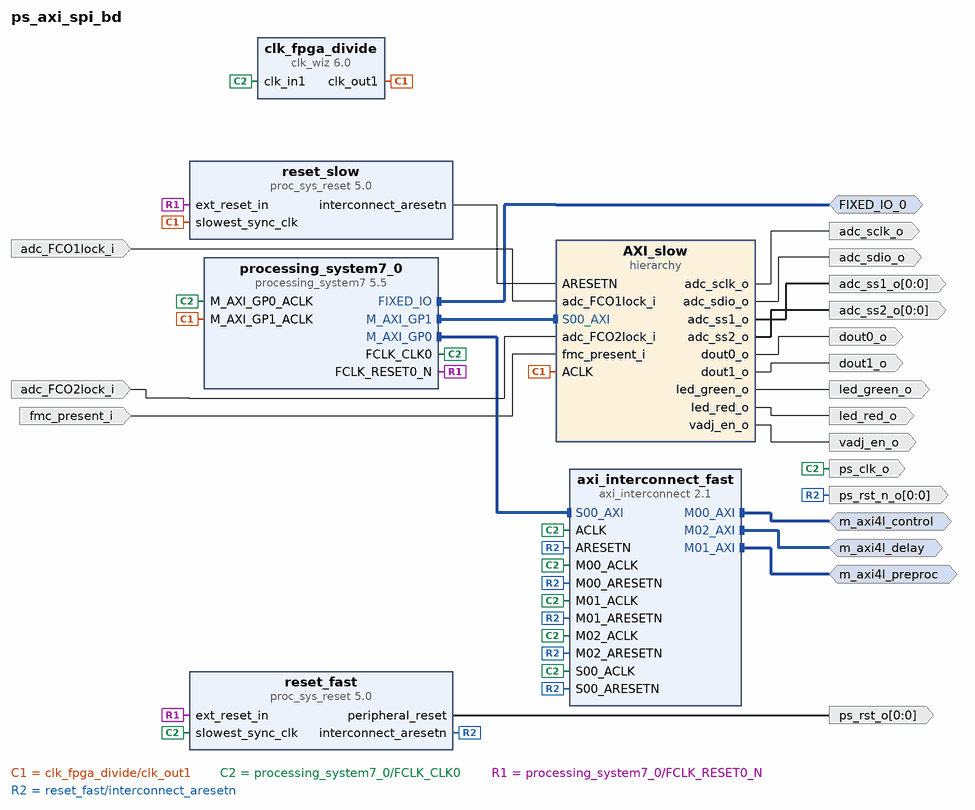
[diagram p0: block diagram of the top level]
# Vivado block design ps_axi_spi_bd, xc7z030fbg676-2, Vivado 2024.2
create_bd_design ps_axi_spi_bd

create_bd_intf_port -mode Master -vlnv xilinx.com:display_processing_system7:fixedio_rtl:1.0 FIXED_IO_0
create_bd_intf_port -mode Master -vlnv xilinx.com:interface:aximm_rtl:1.0 m_axi4l_control
set_property -dict [list \
  CONFIG.ADDR_WIDTH 32 \
  CONFIG.DATA_WIDTH 32 \
  CONFIG.FREQ_HZ 200000000 \
  CONFIG.NUM_READ_OUTSTANDING 2 \
  CONFIG.NUM_WRITE_OUTSTANDING 2 \
  CONFIG.PROTOCOL AXI4LITE \
] [get_bd_intf_ports m_axi4l_control]
create_bd_intf_port -mode Master -vlnv xilinx.com:interface:aximm_rtl:1.0 m_axi4l_delay
set_property -dict [list \
  CONFIG.ADDR_WIDTH 32 \
  CONFIG.DATA_WIDTH 32 \
  CONFIG.FREQ_HZ 200000000 \
  CONFIG.NUM_READ_OUTSTANDING 2 \
  CONFIG.NUM_WRITE_OUTSTANDING 2 \
  CONFIG.PROTOCOL AXI4LITE \
] [get_bd_intf_ports m_axi4l_delay]
create_bd_intf_port -mode Master -vlnv xilinx.com:interface:aximm_rtl:1.0 m_axi4l_preproc
set_property -dict [list \
  CONFIG.ADDR_WIDTH 32 \
  CONFIG.DATA_WIDTH 32 \
  CONFIG.FREQ_HZ 200000000 \
  CONFIG.NUM_READ_OUTSTANDING 2 \
  CONFIG.NUM_WRITE_OUTSTANDING 2 \
  CONFIG.PROTOCOL AXI4LITE \
] [get_bd_intf_ports m_axi4l_preproc]
create_bd_port -dir I adc_FCO1lock_i
create_bd_port -dir I adc_FCO2lock_i
create_bd_port -dir O adc_sclk_o
create_bd_port -dir O adc_sdio_o
create_bd_port -dir O -from 0 -to 0 adc_ss1_o
create_bd_port -dir O -from 0 -to 0 adc_ss2_o
create_bd_port -dir O dout0_o
create_bd_port -dir O dout1_o
create_bd_port -dir I fmc_present_i
create_bd_port -dir O led_green_o
create_bd_port -dir O led_red_o
create_bd_port -dir O -type clk ps_clk_o
set_property -dict [list \
  CONFIG.ASSOCIATED_BUSIF m_axi4l_control:m_axi4l_preproc:m_axi4l_delay \
  CONFIG.FREQ_HZ 200000000 \
] [get_bd_ports ps_clk_o]
create_bd_port -dir O -from 0 -to 0 -type rst ps_rst_n_o
create_bd_port -dir O -from 0 -to 0 -type rst ps_rst_o
create_bd_port -dir O vadj_en_o

create_bd_cell -type hier AXI_slow
create_bd_cell -type ip -vlnv xilinx.com:ip:axi_interconnect:2.1 axi_interconnect_fast
set_property -dict {CONFIG.NUM_MI 3} [get_bd_cells axi_interconnect_fast]
create_bd_cell -type ip -vlnv xilinx.com:ip:clk_wiz:6.0 clk_fpga_divide
set_property -dict [list \
  CONFIG.CLKOUT1_JITTER 129.198 \
  CONFIG.CLKOUT1_REQUESTED_OUT_FREQ 50 \
  CONFIG.MMCM_CLKOUT0_DIVIDE_F 20.000 \
  CONFIG.PRIM_SOURCE Global_buffer \
  CONFIG.USE_LOCKED false \
  CONFIG.USE_RESET false \
] [get_bd_cells clk_fpga_divide]
create_bd_cell -type ip -vlnv xilinx.com:ip:processing_system7:5.5 processing_system7_0
set_property -dict [list \
  CONFIG.PCW_APU_PERIPHERAL_FREQMHZ 800 \
  CONFIG.PCW_CPU_CPU_6X4X_MAX_RANGE 800 \
  CONFIG.PCW_ENET0_ENET0_IO {MIO 16 .. 27} \
  CONFIG.PCW_ENET0_GRP_MDIO_ENABLE 1 \
  CONFIG.PCW_ENET0_GRP_MDIO_IO {MIO 52 .. 53} \
  CONFIG.PCW_ENET0_PERIPHERAL_ENABLE 1 \
  CONFIG.PCW_FCLK2_PERIPHERAL_CLKSRC {DDR PLL} \
  CONFIG.PCW_FPGA0_PERIPHERAL_FREQMHZ 200 \
  CONFIG.PCW_FPGA1_PERIPHERAL_FREQMHZ 250 \
  CONFIG.PCW_FPGA2_PERIPHERAL_FREQMHZ 100 \
  CONFIG.PCW_GPIO_MIO_GPIO_ENABLE 0 \
  CONFIG.PCW_I2C0_GRP_INT_ENABLE 0 \
  CONFIG.PCW_I2C0_I2C0_IO {MIO 14 .. 15} \
  CONFIG.PCW_I2C0_PERIPHERAL_ENABLE 1 \
  CONFIG.PCW_I2C1_I2C1_IO {MIO 12 .. 13} \
  CONFIG.PCW_I2C1_PERIPHERAL_ENABLE 1 \
  CONFIG.PCW_I2C_PERIPHERAL_FREQMHZ 133.333328 \
  CONFIG.PCW_PERIPHERAL_BOARD_PRESET part0 \
  CONFIG.PCW_PRESET_BANK1_VOLTAGE {LVCMOS 1.8V} \
  CONFIG.PCW_QSPI_GRP_SINGLE_SS_ENABLE 1 \
  CONFIG.PCW_QSPI_GRP_SINGLE_SS_IO {MIO 1 .. 6} \
  CONFIG.PCW_QSPI_PERIPHERAL_ENABLE 1 \
  CONFIG.PCW_QSPI_PERIPHERAL_FREQMHZ 150 \
  CONFIG.PCW_QSPI_QSPI_IO {MIO 1 .. 6} \
  CONFIG.PCW_SD0_GRP_CD_ENABLE 0 \
  CONFIG.PCW_SD0_GRP_WP_ENABLE 0 \
  CONFIG.PCW_SD0_PERIPHERAL_ENABLE 1 \
  CONFIG.PCW_SD0_SD0_IO {MIO 40 .. 45} \
  CONFIG.PCW_SDIO_PERIPHERAL_FREQMHZ 50 \
  CONFIG.PCW_SINGLE_QSPI_DATA_MODE x4 \
  CONFIG.PCW_UART0_PERIPHERAL_ENABLE 1 \
  CONFIG.PCW_UART0_UART0_IO {MIO 10 .. 11} \
  CONFIG.PCW_UART1_PERIPHERAL_ENABLE 1 \
  CONFIG.PCW_UART1_UART1_IO {MIO 8 .. 9} \
  CONFIG.PCW_UART_PERIPHERAL_FREQMHZ 100 \
  CONFIG.PCW_UIPARAM_DDR_ENABLE 0 \
  CONFIG.PCW_USB0_PERIPHERAL_ENABLE 0 \
  CONFIG.PCW_USE_M_AXI_GP1 1 \
] [get_bd_cells processing_system7_0]
# 421 more settings of processing_system7_0 are not shown: defaults, MIO pin electricals, DDR timing, and values the tool derives
create_bd_cell -type ip -vlnv xilinx.com:ip:proc_sys_reset:5.0 reset_fast
set_property -dict [list \
  CONFIG.C_AUX_RST_WIDTH 1 \
  CONFIG.C_EXT_RST_WIDTH 1 \
  CONFIG.C_NUM_BUS_RST 1 \
  CONFIG.C_NUM_PERP_RST 1 \
] [get_bd_cells reset_fast]
create_bd_cell -type ip -vlnv xilinx.com:ip:proc_sys_reset:5.0 reset_slow
set_property -dict {CONFIG.C_EXT_RST_WIDTH 1} [get_bd_cells reset_slow]

# ---- hierarchy /AXI_slow ----
current_bd_instance /AXI_slow
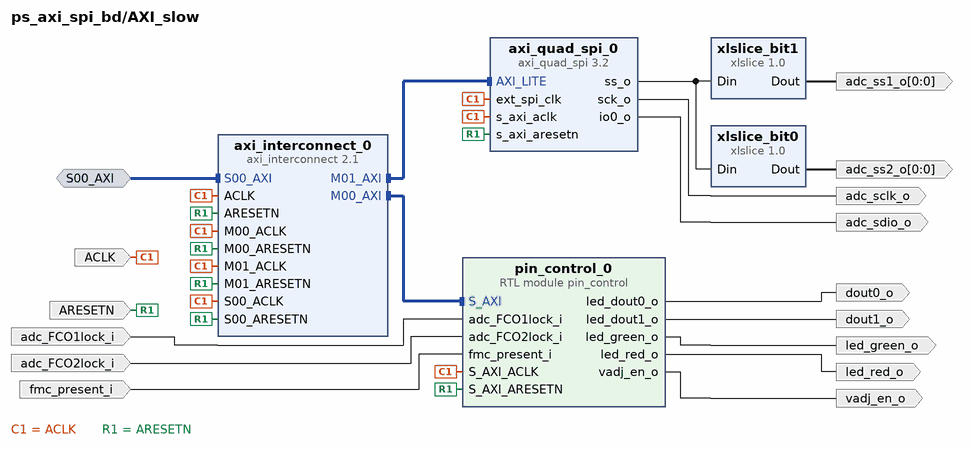
[diagram p1: block diagram inside /AXI_slow]
create_bd_intf_pin -mode Slave -vlnv xilinx.com:interface:aximm_rtl:1.0 S00_AXI
create_bd_pin -dir I -type clk ACLK
create_bd_pin -dir I -type rst ARESETN
create_bd_pin -dir I adc_FCO1lock_i
create_bd_pin -dir I adc_FCO2lock_i
create_bd_pin -dir O adc_sclk_o
create_bd_pin -dir O adc_sdio_o
create_bd_pin -dir O -from 0 -to 0 adc_ss1_o
create_bd_pin -dir O -from 0 -to 0 adc_ss2_o
create_bd_pin -dir O dout0_o
create_bd_pin -dir O dout1_o
create_bd_pin -dir I fmc_present_i
create_bd_pin -dir O led_green_o
create_bd_pin -dir O led_red_o
create_bd_pin -dir O vadj_en_o

create_bd_cell -type ip -vlnv xilinx.com:ip:axi_interconnect:2.1 axi_interconnect_0
create_bd_cell -type ip -vlnv xilinx.com:ip:axi_quad_spi:3.2 axi_quad_spi_0
set_property -dict [list \
  CONFIG.C_NUM_SS_BITS 2 \
  CONFIG.C_NUM_TRANSFER_BITS 8 \
  CONFIG.C_SCK_RATIO 2 \
  CONFIG.C_USE_STARTUP 0 \
] [get_bd_cells axi_quad_spi_0]
create_bd_cell -type module -reference pin_control pin_control_0
set_property -dict {CONFIG.MAX_COUNT_1MS 50000} [get_bd_cells pin_control_0]
create_bd_cell -type ip -vlnv xilinx.com:ip:xlslice:1.0 xlslice_bit0
set_property -dict {CONFIG.DIN_FROM 0 CONFIG.DIN_TO 0 CONFIG.DIN_WIDTH 2 CONFIG.DOUT_WIDTH 1} [get_bd_cells xlslice_bit0]
create_bd_cell -type ip -vlnv xilinx.com:ip:xlslice:1.0 xlslice_bit1
set_property -dict {CONFIG.DIN_FROM 1 CONFIG.DIN_TO 1 CONFIG.DIN_WIDTH 2 CONFIG.DOUT_WIDTH 1} [get_bd_cells xlslice_bit1]

# ---- connections ----

current_bd_instance /AXI_slow
connect_bd_intf_net [get_bd_intf_pins axi_interconnect_0/M00_AXI] [get_bd_intf_pins pin_control_0/S_AXI]
connect_bd_intf_net [get_bd_intf_pins axi_interconnect_0/M01_AXI] [get_bd_intf_pins axi_quad_spi_0/AXI_LITE]
connect_bd_intf_net -intf_net processing_system7_0_M_AXI_GP1 [get_bd_intf_pins S00_AXI] [get_bd_intf_pins axi_interconnect_0/S00_AXI]
connect_bd_net [get_bd_pins ACLK] \
  [get_bd_pins axi_interconnect_0/ACLK] [get_bd_pins axi_interconnect_0/M00_ACLK] [get_bd_pins axi_interconnect_0/M01_ACLK] \
  [get_bd_pins axi_interconnect_0/S00_ACLK] [get_bd_pins axi_quad_spi_0/ext_spi_clk] [get_bd_pins axi_quad_spi_0/s_axi_aclk] \
  [get_bd_pins pin_control_0/S_AXI_ACLK]
connect_bd_net -net ADC_AcqControl_adc_FCO1lck_o [get_bd_pins adc_FCO1lock_i] [get_bd_pins pin_control_0/adc_FCO1lock_i]
connect_bd_net -net ADC_AcqControl_adc_FCO2lck_o [get_bd_pins adc_FCO2lock_i] [get_bd_pins pin_control_0/adc_FCO2lock_i]
connect_bd_net [get_bd_pins axi_quad_spi_0/io0_o] [get_bd_pins adc_sdio_o]
connect_bd_net [get_bd_pins axi_quad_spi_0/sck_o] [get_bd_pins adc_sclk_o]
connect_bd_net [get_bd_pins axi_quad_spi_0/ss_o] [get_bd_pins xlslice_bit0/Din] [get_bd_pins xlslice_bit1/Din]
connect_bd_net -net fmc_present_i_0_1 [get_bd_pins fmc_present_i] [get_bd_pins pin_control_0/fmc_present_i]
connect_bd_net [get_bd_pins pin_control_0/led_dout0_o] [get_bd_pins dout0_o]
connect_bd_net [get_bd_pins pin_control_0/led_dout1_o] [get_bd_pins dout1_o]
connect_bd_net [get_bd_pins pin_control_0/led_green_o] [get_bd_pins led_green_o]
connect_bd_net [get_bd_pins pin_control_0/led_red_o] [get_bd_pins led_red_o]
connect_bd_net [get_bd_pins pin_control_0/vadj_en_o] [get_bd_pins vadj_en_o]
connect_bd_net -net reset_slow_interconnect_aresetn [get_bd_pins ARESETN] \
  [get_bd_pins axi_interconnect_0/ARESETN] [get_bd_pins axi_interconnect_0/M00_ARESETN] \
  [get_bd_pins axi_interconnect_0/M01_ARESETN] [get_bd_pins axi_interconnect_0/S00_ARESETN] \
  [get_bd_pins axi_quad_spi_0/s_axi_aresetn] [get_bd_pins pin_control_0/S_AXI_ARESETN]
connect_bd_net [get_bd_pins xlslice_bit0/Dout] [get_bd_pins adc_ss2_o]
connect_bd_net [get_bd_pins xlslice_bit1/Dout] [get_bd_pins adc_ss1_o]

current_bd_instance /
connect_bd_intf_net -intf_net S00_AXI_0_1 [get_bd_intf_pins axi_interconnect_fast/S00_AXI] [get_bd_intf_pins processing_system7_0/M_AXI_GP0]
connect_bd_intf_net [get_bd_intf_ports m_axi4l_control] [get_bd_intf_pins axi_interconnect_fast/M00_AXI]
connect_bd_intf_net [get_bd_intf_ports m_axi4l_preproc] [get_bd_intf_pins axi_interconnect_fast/M01_AXI]
connect_bd_intf_net [get_bd_intf_ports m_axi4l_delay] [get_bd_intf_pins axi_interconnect_fast/M02_AXI]
connect_bd_intf_net [get_bd_intf_ports FIXED_IO_0] [get_bd_intf_pins processing_system7_0/FIXED_IO]
connect_bd_intf_net [get_bd_intf_pins AXI_slow/S00_AXI] [get_bd_intf_pins processing_system7_0/M_AXI_GP1]
connect_bd_net -net ACLK_1 [get_bd_pins clk_fpga_divide/clk_out1] \
  [get_bd_pins AXI_slow/ACLK] [get_bd_pins processing_system7_0/M_AXI_GP1_ACLK] [get_bd_pins reset_slow/slowest_sync_clk]
connect_bd_net -net adc_FCO1lock_i_0_1 [get_bd_ports adc_FCO1lock_i] [get_bd_pins AXI_slow/adc_FCO1lock_i]
connect_bd_net -net adc_FCO2lock_i_0_1 [get_bd_ports adc_FCO2lock_i] [get_bd_pins AXI_slow/adc_FCO2lock_i]
connect_bd_net -net axi_spi_control_0_adc_sclk_o [get_bd_pins AXI_slow/adc_sclk_o] [get_bd_ports adc_sclk_o]
connect_bd_net -net axi_spi_control_0_adc_sdio_o [get_bd_pins AXI_slow/adc_sdio_o] [get_bd_ports adc_sdio_o]
connect_bd_net -net axi_spi_control_0_adc_ss1_o [get_bd_pins AXI_slow/adc_ss1_o] [get_bd_ports adc_ss1_o]
connect_bd_net -net axi_spi_control_0_adc_ss2_o [get_bd_pins AXI_slow/adc_ss2_o] [get_bd_ports adc_ss2_o]
connect_bd_net -net fmc_present_i_0_1 [get_bd_ports fmc_present_i] [get_bd_pins AXI_slow/fmc_present_i]
connect_bd_net -net pin_control_0_led_dout0_o [get_bd_pins AXI_slow/dout0_o] [get_bd_ports dout0_o]
connect_bd_net -net pin_control_0_led_dout1_o [get_bd_pins AXI_slow/dout1_o] [get_bd_ports dout1_o]
connect_bd_net -net pin_control_0_led_green_o [get_bd_pins AXI_slow/led_green_o] [get_bd_ports led_green_o]
connect_bd_net -net pin_control_0_led_red_o [get_bd_pins AXI_slow/led_red_o] [get_bd_ports led_red_o]
connect_bd_net -net pin_control_0_vadj_en_o [get_bd_pins AXI_slow/vadj_en_o] [get_bd_ports vadj_en_o]
connect_bd_net [get_bd_pins processing_system7_0/FCLK_CLK0] \
  [get_bd_ports ps_clk_o] [get_bd_pins axi_interconnect_fast/ACLK] [get_bd_pins axi_interconnect_fast/M00_ACLK] \
  [get_bd_pins axi_interconnect_fast/M01_ACLK] [get_bd_pins axi_interconnect_fast/M02_ACLK] \
  [get_bd_pins axi_interconnect_fast/S00_ACLK] [get_bd_pins clk_fpga_divide/clk_in1] \
  [get_bd_pins processing_system7_0/M_AXI_GP0_ACLK] [get_bd_pins reset_fast/slowest_sync_clk]
connect_bd_net [get_bd_pins processing_system7_0/FCLK_RESET0_N] [get_bd_pins reset_fast/ext_reset_in] [get_bd_pins reset_slow/ext_reset_in]
connect_bd_net [get_bd_pins reset_fast/interconnect_aresetn] \
  [get_bd_ports ps_rst_n_o] [get_bd_pins axi_interconnect_fast/ARESETN] [get_bd_pins axi_interconnect_fast/M00_ARESETN] \
  [get_bd_pins axi_interconnect_fast/M01_ARESETN] [get_bd_pins axi_interconnect_fast/M02_ARESETN] \
  [get_bd_pins axi_interconnect_fast/S00_ARESETN]
connect_bd_net [get_bd_pins reset_fast/peripheral_reset] [get_bd_ports ps_rst_o]
connect_bd_net [get_bd_pins reset_slow/interconnect_aresetn] [get_bd_pins AXI_slow/ARESETN]

# ---- address map ----
assign_bd_address -offset 0x43C00000 -range 64K -target_address_space [get_bd_addr_spaces processing_system7_0/Data] [get_bd_addr_segs m_axi4l_control/Reg]
assign_bd_address -offset 0x43C10000 -range 64K -target_address_space [get_bd_addr_spaces processing_system7_0/Data] [get_bd_addr_segs m_axi4l_delay/Reg]
assign_bd_address -offset 0x43C30000 -range 64K -target_address_space [get_bd_addr_spaces processing_system7_0/Data] [get_bd_addr_segs m_axi4l_preproc/Reg]
assign_bd_address -offset 0x81E00000 -range 64K -target_address_space [get_bd_addr_spaces processing_system7_0/Data] [get_bd_addr_segs AXI_slow/axi_quad_spi_0/AXI_LITE/Reg]
assign_bd_address -offset 0x83C10000 -range 64K -target_address_space [get_bd_addr_spaces processing_system7_0/Data] [get_bd_addr_segs AXI_slow/pin_control_0/S_AXI/reg0]

validate_bd_design
save_bd_design
